# Altium schematic sheet 04_ADC.SchDoc
size 513 x 386 mm
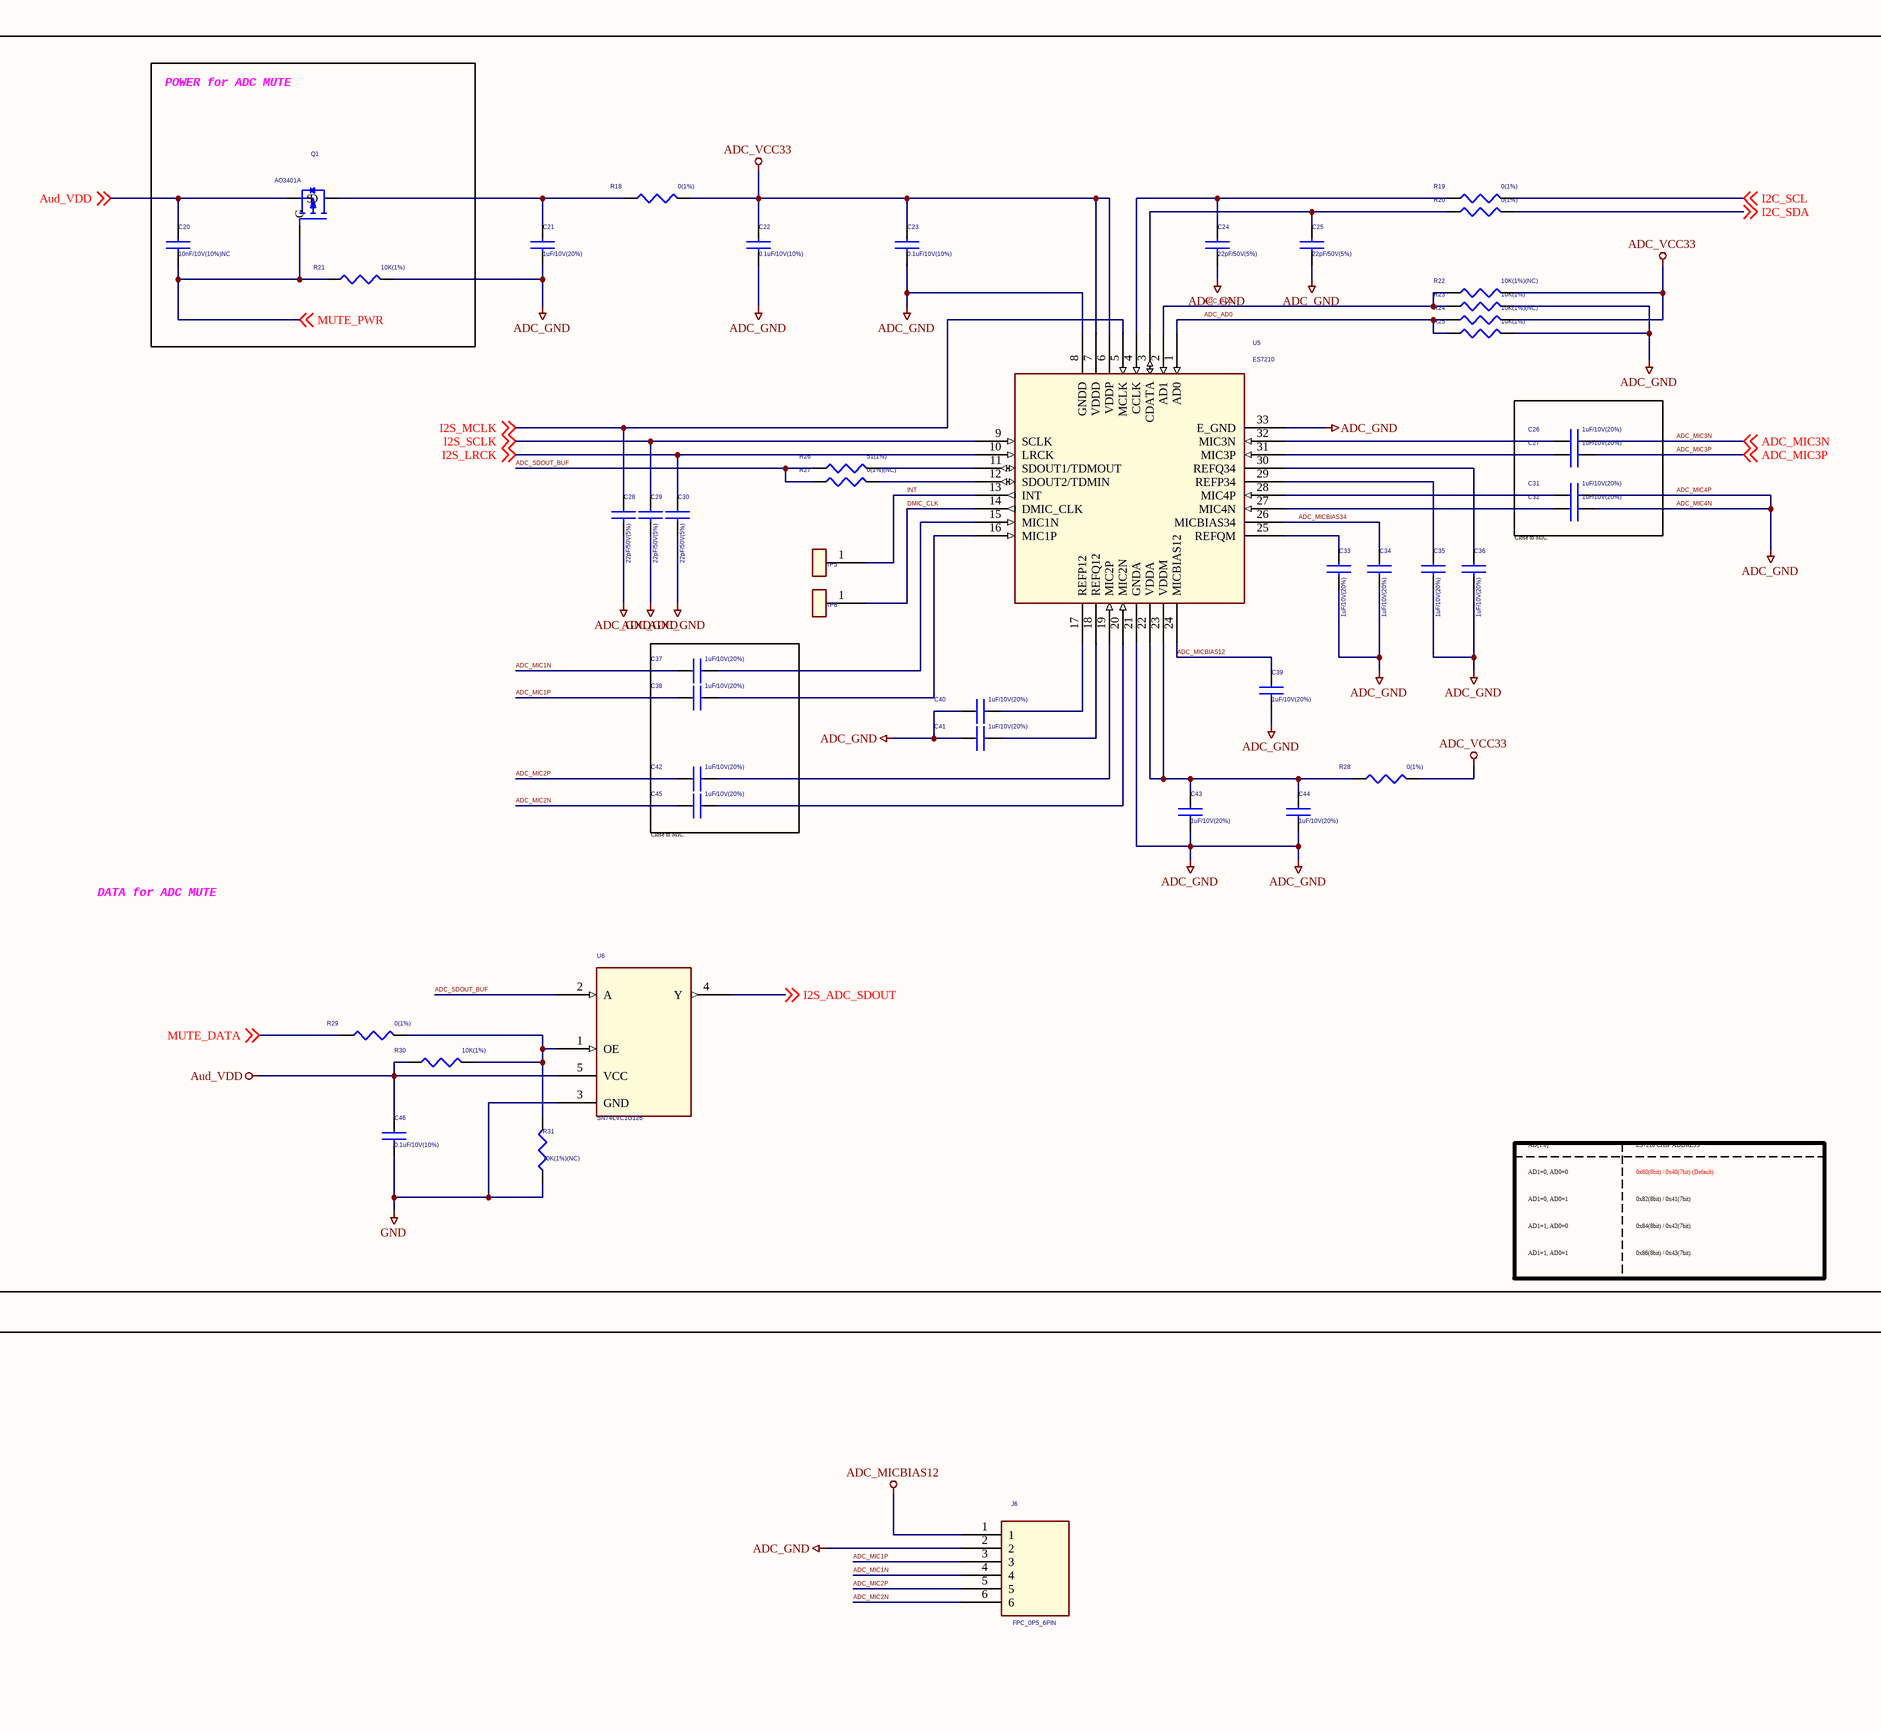
[diagram p0: 04_ADC.SchDoc, left]
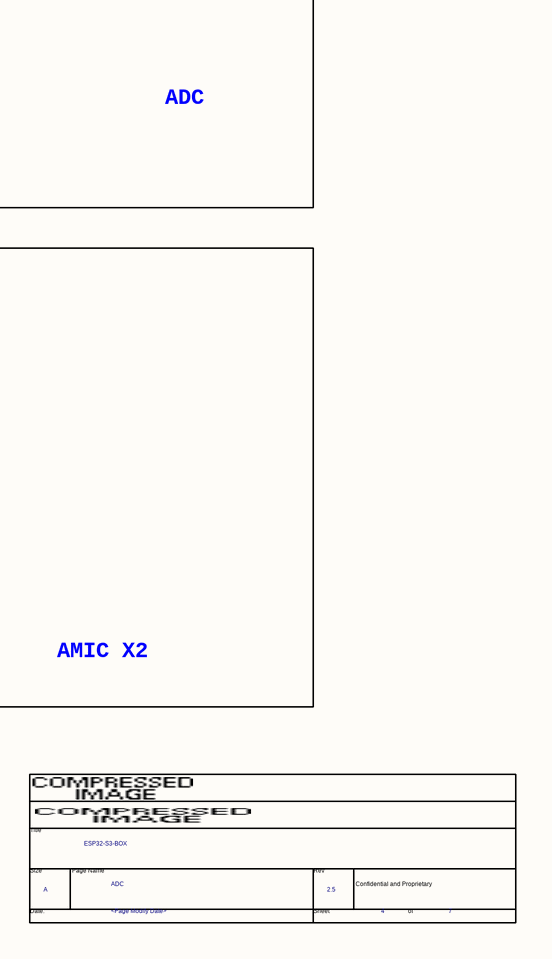
[diagram p1: 04_ADC.SchDoc, right]

## Parts
*  Page Modify Date: <Page Modify Date>  Page Name: ADC  Title: ESP32-S3-BOX  Page Size: A  Page Number: 4  Page Count: 7  RevCode: 2.5  (hidden comment: espTitleBlock3)  (graphical)
C20  10nF/10V(10%)NC  [C0201]
C21  1uF/10V(20%)  [C0201]
C22  0.1uF/10V(10%)  [C0201]
C23  0.1uF/10V(10%)  [C0201]
C24  22pF/50V(5%)  [C0201]
C25  22pF/50V(5%)  [C0201]
C26  1uF/10V(20%)  [C0201]
C27  1uF/10V(20%)  [C0201]
C28  22pF/50V(5%)  [C0201]
C29  22pF/50V(5%)  [C0201]
C30  22pF/50V(5%)  [C0201]
C31  1uF/10V(20%)  [C0201]
C32  1uF/10V(20%)  [C0201]
C33  1uF/10V(20%)  [C0201]
C34  1uF/10V(20%)  [C0201]
C35  1uF/10V(20%)  [C0201]
C36  1uF/10V(20%)  [C0201]
C37  1uF/10V(20%)  [C0201]
C38  1uF/10V(20%)  [C0201]
C39  1uF/10V(20%)  [C0201]
C40  1uF/10V(20%)  [C0201]
C41  1uF/10V(20%)  [C0201]
C42  1uF/10V(20%)  [C0201]
C43  1uF/10V(20%)  [C0201]
C44  1uF/10V(20%)  [C0201]
C45  1uF/10V(20%)  [C0201]
C46  0.1uF/10V(10%)  [C0201]
J6  FPC_0P5_6PIN  [FPC_0P5_6PIN]
Q1  AO3401A  [SOT23-3]
R18  0(1%)  [R0402]
R19  0(1%)  [R0201]
R20  0(1%)  [R0201]
R21  10K(1%)  [R0201]
R22  10K(1%)(NC)  [R0201]
R23  10K(1%)  [R0201]
R24  10K(1%)(NC)  [R0201]
R25  10K(1%)  [R0201]
R26  51(1%)  [R0201]
R27  0(1%)(NC)  [R0201]
R28  0(1%)  [R0402]
R29  0(1%)  [R0201]
R30  10K(1%)  [R0201]
R31  10K(1%)(NC)  [R0201]
TP5  TESTPOINT  [TPC_D40]  (value not drawn)
TP6  TESTPOINT  [TPC_D40]  (value not drawn)
U5  ES7210  [QFN32_0P4_4]
U6  SN74LVC1G126  [SC70-5]

## Blocks framed on the sheet
ADC: C21-C46 R18-R20 R22-R31 TP5 TP6 U5 U6
POWER for ADC MUTE: C20 Q1 R21
AMIC X2: J6

## Nets
ADC_MIC4N: C21.2 C22.2 C23.2 C24.2 C25.2 C28.2 C29.2 C30.2 C31.2 C32.2 C33.2 C34.2 C35.2 C36.2 C39.2 C40.1 C41.1 C43.2 C44.2 J6.2 R21.2 R23.2 R25.2 U5.8(GNDD) U5.21(GNDA) U5.33(E_GND)  [also labelled ADC_GND, ADC_MIC4P]
ADC_MICBIAS12: C39.1 J6.1 U5.24(MICBIAS12)
ADC_VCC33: C22.1 C23.1 R18.2 R22.2 R24.2 R28.2 U5.6(VDDP) U5.7(VDDD)
Aud_VDD: C20.1 C46.1 Q1.2(S) R30.1 U6.5(VCC) ; off-sheet Aud_VDD
GND: C46.2 R31.1 U6.3(GND)
ADC_AD0: R24.1 R25.1 U5.1(AD0)
ADC_AD1: R22.1 R23.1 U5.2(AD1)
ADC_MIC1N: C37.1 J6.4
ADC_MIC1P: C38.1 J6.3
ADC_MIC2N: C45.1 J6.6
ADC_MIC2P: C42.1 J6.5
ADC_MIC3N: C26.2 ; off-sheet ADC_MIC3N
ADC_MIC3P: C27.2 ; off-sheet ADC_MIC3P
ADC_MICBIAS34: C34.1 U5.26(MICBIAS34)
ADC_SDOUT_BUF: R26.1 R27.1 U6.2(A)
DMIC_CLK: TP6.1 U5.14(DMIC_CLK)
I2C_SCL: R19.2 ; off-sheet I2C_SCL
I2C_SDA: R20.2 ; off-sheet I2C_SDA
I2S_ADC_SDOUT: U6.4(Y) ; off-sheet I2S_ADC_SDOUT
I2S_LRCK: C30.1 U5.10(LRCK) ; off-sheet I2S_LRCK
I2S_MCLK: C28.1 U5.5(MCLK) ; off-sheet I2S_MCLK
I2S_SCLK: C29.1 U5.9(SCLK) ; off-sheet I2S_SCLK
INT: TP5.1 U5.13(INT)
MUTE_DATA: R29.1 ; off-sheet MUTE_DATA
MUTE_PWR: C20.2 Q1.1(G) R21.1 ; off-sheet MUTE_PWR
NetC21_1: C21.1 Q1.3(D) R18.1
NetC24_1: C24.1 R19.1 U5.4(CCLK)
NetC25_1: C25.1 R20.1 U5.3(CDATA)
NetC26_1: C26.1 U5.32(MIC3N)
NetC27_1: C27.1 U5.31(MIC3P)
NetC31_1: C31.1 U5.28(MIC4P)
NetC32_1: C32.1 U5.27(MIC4N)
NetC33_1: C33.1 U5.25(REFQM)
NetC35_1: C35.1 U5.29(REFP34)
NetC36_1: C36.1 U5.30(REFQ34)
NetC37_2: C37.2 U5.15(MIC1N)
NetC38_2: C38.2 U5.16(MIC1P)
NetC40_2: C40.2 U5.17(REFP12)
NetC41_2: C41.2 U5.18(REFQ12)
NetC42_2: C42.2 U5.19(MIC2P)
NetC43_1: C43.1 C44.1 R28.1 U5.22(VDDA) U5.23(VDDM)
NetC45_2: C45.2 U5.20(MIC2N)
NetR26_2: R26.2 U5.11(SDOUT1/TDMOUT)
NetR27_2: R27.2 U5.12(SDOUT2/TDMIN)
NetR29_2: R29.2 R30.2 R31.2 U6.1(OE)

## Notes on the sheet
- Close to MIC.
- (near C45) Close to MIC.
- DATA for ADC MUTE
- AD[1:0]
- ES7210 CHIP ADDRESS
- AD1=0, AD0=0
- AD1=0, AD0=1
- AD1=1, AD0=0
- 0x80(8bit) / 0x40(7bit) (Default)
- 0x82(8bit) / 0x41(7bit)
- 0x84(8bit) / 0x42(7bit)
- AD1=1, AD0=1
- 0x86(8bit) / 0x43(7bit)
- (in symbol espTitleBlock3) Title; Size; Page Name; Rev; Confidential and Proprietary; Date:; Sheet; of

## Library data of the parts
* = espTitleBlock3: Doc: ESP32-S3-EYE_V1.0; OrgName: ESPRESSIF
C20 = CAPACITOR: Part Number: ES11024103600000; CODE12: ES11.02.410.3.6.0.00; Part Type: Capacitor
C21 C26 C27 C31-C45 = CAPACITOR: Part Number: ES11026103700001; CODE12: ES11.02.610.3.7.0.00; Part Type: Capacitor
C22 C23 C46 = CAPACITOR: Part Number: ES11025103610001; CODE12: ES11.02.510.3.6.1.00; Part Type: Capacitor
C24 C25 C28-C30 = CAPACITOR: Part Number: ES11021226520000; CODE12: ES11.02.122.6.5.2.00; Part Type: Capacitor
Q1 = PMOS: Part Number: ES31460000000000; CODE12: ES31.46.0000.00.0.0; Part Type: Transistor
R18 R28 = RESISTOR: Part Number: ES21040000000001; CODE12: ES21.04.0000.0.00.0; Part Type: Resistor
R19 R20 R27 R29 = RESISTOR: Part Number: ES21020000000001; CODE12: ES21.02.0000.0.00.0; Part Type: Resistor
R21-R25 R30 R31 = RESISTOR: Part Number: ES21024100000001; CODE12: ES21.02.4100.0.00.0; Part Type: Resistor
R26 = RESISTOR: Part Number: ES21021510000001; CODE12: ES21.02.1510.0.00.0; Part Type: Resistor
TP5 TP6 = TESTPOINT: Part Number: ES51990010000000; CODE12: ES51.99.0010.00.00; Part Type: -
U5 = ES7210: Part Number: ES41181401000000; CODE12: ES41.18.14.01.00.00; Part Type: Audio ICs